# Altium project supersensor.PrjPcb
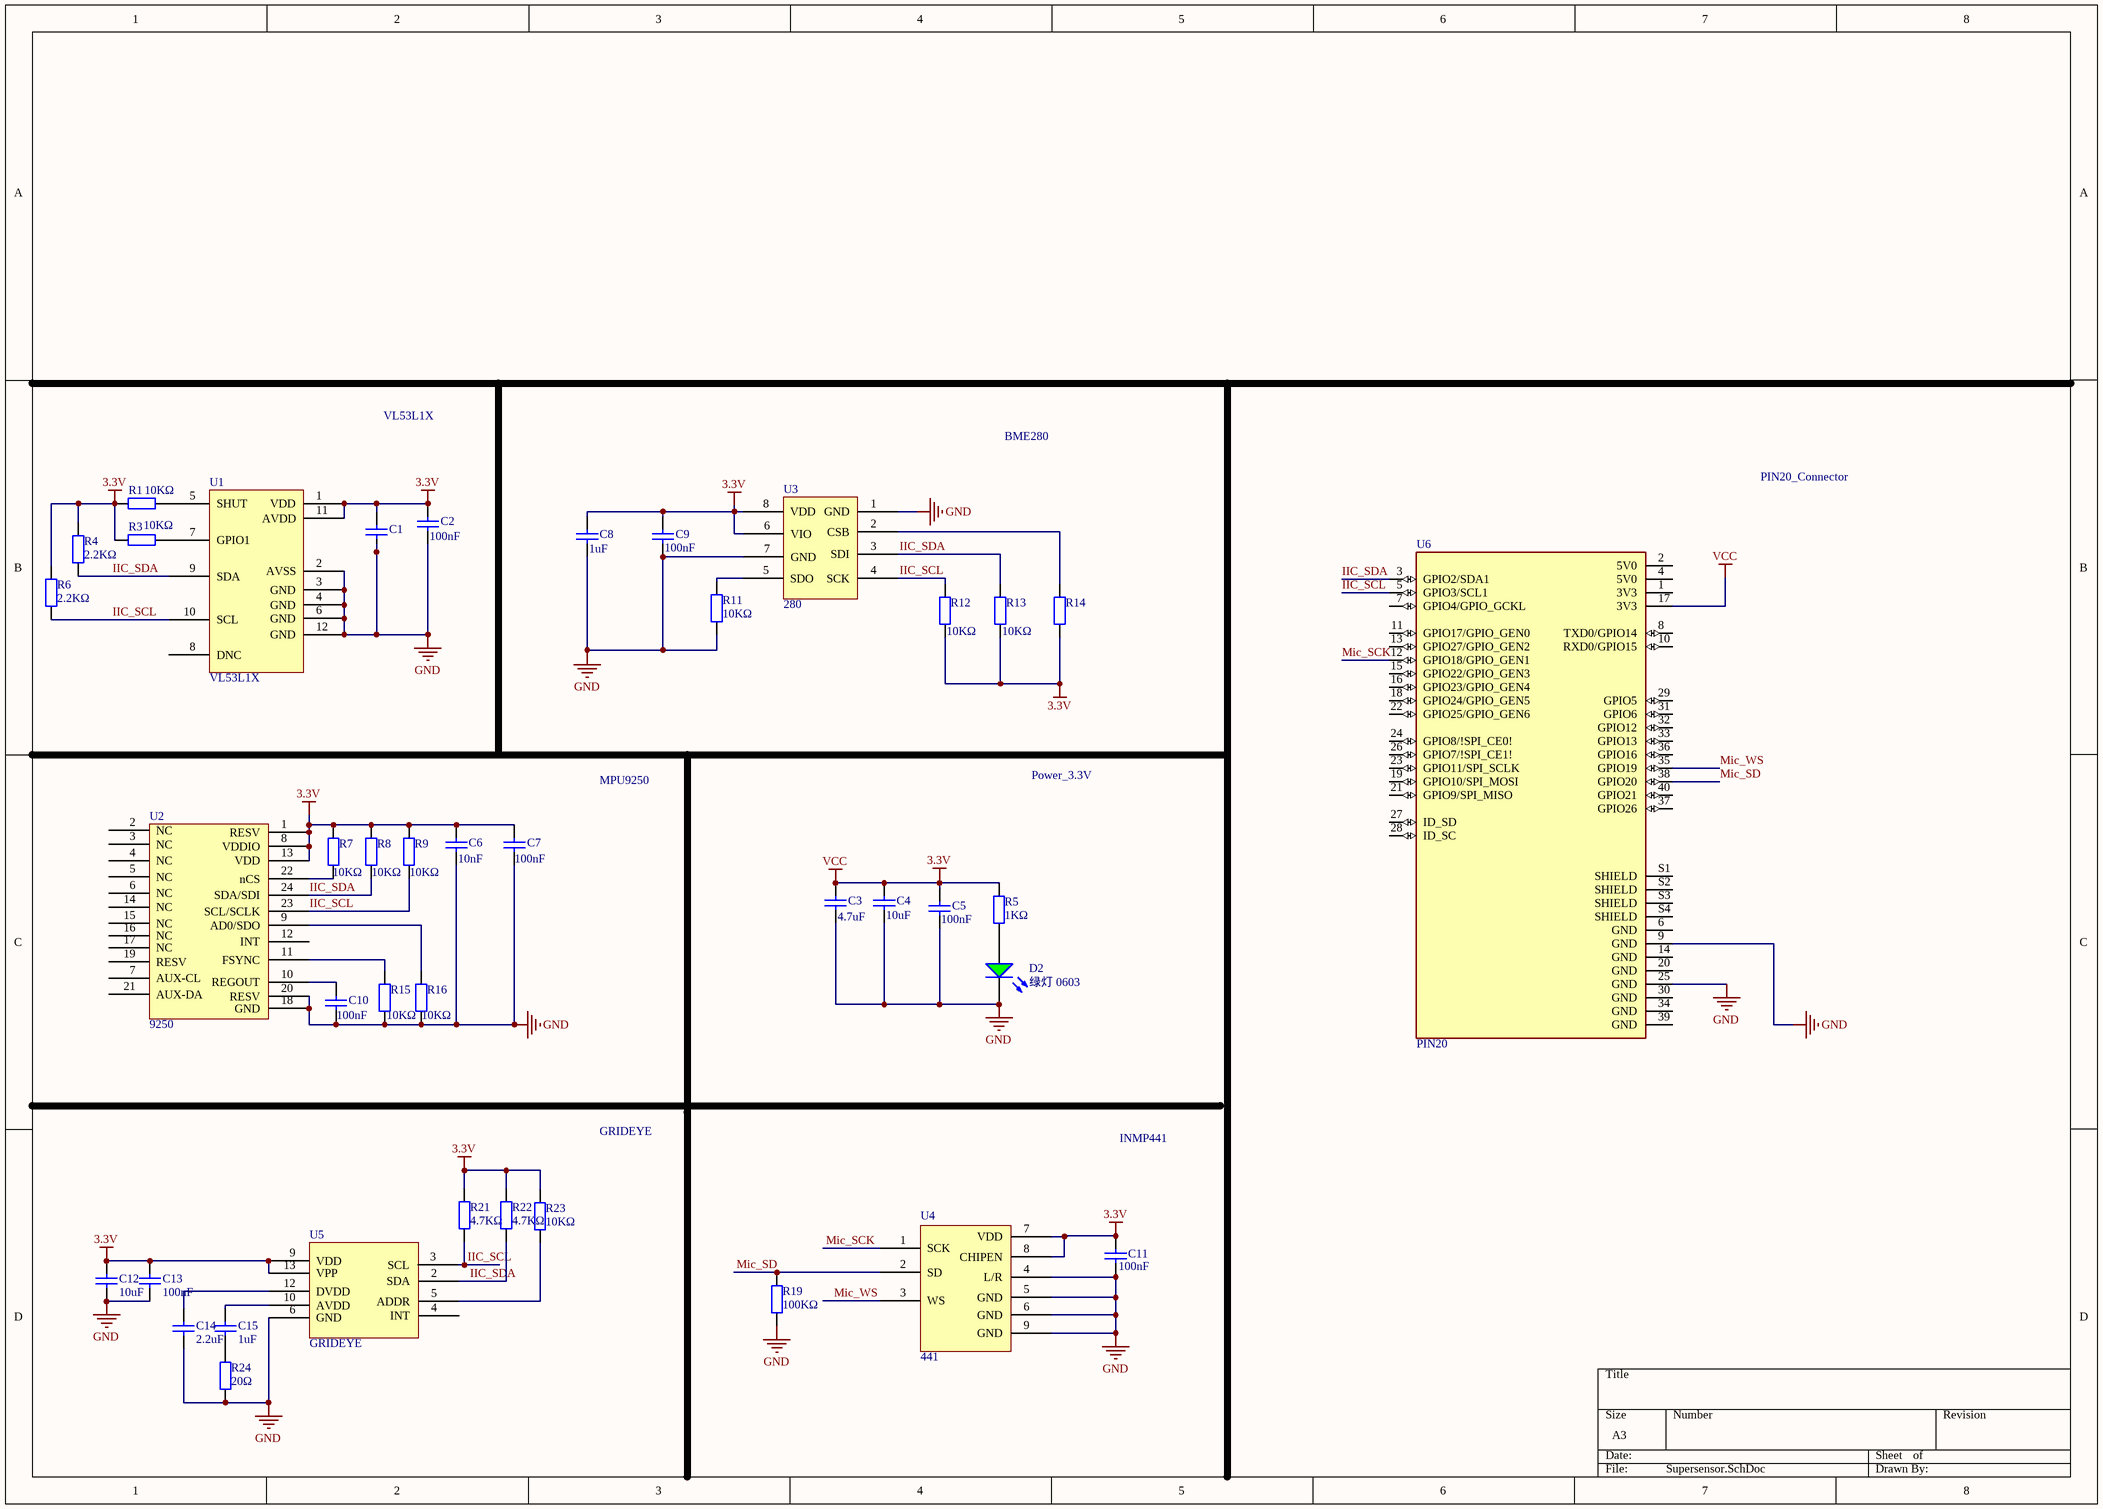
[diagram p0: Supersensor.SchDoc]
Title: Supersensor
1 sheet, 41 parts. Net scope: global (net labels, ports and power ports of the same name join across sheets).
Board file: supersensor.PcbDoc

## Sheet Supersensor.SchDoc: Supersensor
size A3; SheetNumber: 1; SheetTotal: 1

### Parts
C1  (no value)  [0603_C]
C2  100nF  [0603_C]
C3  4.7uF  [0603_C]
C4  10uF  [0603_C]
C5  100nF  [0603_C]
C6  10nF  [0603_C]
C7  100nF  [0603_C]
C8  1uF  [0603_C]
C9  100nF  [0603_C]
C10  100nF  [0603_C]
C11  100nF  [0603_C]
C12  10uF  [0603_C]
C13  100nF  [0603_C]
C14  2.2uF  [0603_C]
C15  1uF  [0603_C]
D2  绿灯 0603  [0603_LED_S1]
R1  10KΩ  [0603_R]
R3  10KΩ  [0603_R]
R4  2.2KΩ  [0603_R]
R5  1KΩ  [0603_R]
R6  2.2KΩ  [0603_R]
R7  10KΩ  [0603_R]
R8  10KΩ  [0603_R]
R9  10KΩ  [0603_R]
R11  10KΩ  [0603_R]
R12  10KΩ  [0603_R]
R13  10KΩ  [0603_R]
R14  (no value)  [0603_R]
R15  10KΩ  [0603_R]
R16  10KΩ  [0603_R]
R19  100KΩ  [0603_R]
R21  4.7KΩ  [0603_R]
R22  4.7KΩ  [0603_R]
R23  10KΩ  [0603_R]
R24  20Ω  [0603_R]
U1  VL53L1X  [VL53L1X]
U2  9250  [MPU9250]
U3  280  [BME280]
U4  441  [INMP441]
U5  GRIDEYE  [AMG8833]
U6  PIN20  [PIN20]

### Nets
3.3V: C1.2 C2.2 C3.2 C4.2 C5.2 C6.2 C7.2 C8.2 C9.2 C11.2 C12.2 C13.2 R1.1 R3.1 R4.1 R5.2 R6.1 R7.2 R8.2 R9.2 R12.1 R13.1 R14.1 R21.2 R22.2 R23.2 U1.1(VDD) U1.11(AVDD) U2.1(RESV) U2.8(VDDIO) U2.13(VDD) U3.6(VIO) U3.8(VDD) U4.7(VDD) U4.8(CHIPEN) U5.9(VDD) U5.13(VPP) U6.17(3V3)  [also labelled VCC]
GND: C1.1 C2.1 C3.1 C4.1 C5.1 C6.1 C7.1 C8.1 C9.1 C10.1 C11.1 C12.1 C13.1 C14.1 D2.K R11.1 R15.1 R16.1 R19.1 R24.1 U1.2(AVSS) U1.3(GND) U1.4(GND) U1.6(GND) U1.12(GND) U2.18(GND) U2.20(RESV) U3.1(GND) U3.7(GND) U4.4(L/R) U4.5(GND) U4.6(GND) U4.9(GND) U5.6(GND) U6.9(GND) U6.25(GND)
IIC_SCL: R6.2 R9.1 R12.2 R21.1 U1.10(SCL) U2.23(SCL/SCLK) U3.4(SCK) U5.3(SCL) U6.5(GPIO3/SCL1)
IIC_SDA: R4.2 R8.1 R13.2 R22.1 U1.9(SDA) U2.24(SDA/SDI) U3.3(SDI) U5.2(SDA) U6.3(GPIO2/SDA1)
Mic_SCK: U4.1(SCK) U6.12(GPIO18/GPIO_GEN1)
Mic_SD: R19.2 U4.2(SD) U6.38(GPIO20)
Mic_WS: U4.3(WS) U6.35(GPIO19)
NetC10_2: C10.2 U2.10(REGOUT)
NetC14_2: C14.2 U5.12(DVDD)
NetC15_1: C15.1 R24.2
NetC15_2: C15.2 U5.10(AVDD)
NetD2_A: D2.A R5.1
NetR1_2: R1.2 U1.5(SHUT)
NetR3_2: R3.2 U1.7(GPIO1)
NetR7_1: R7.1 U2.22(nCS)
NetR11_2: R11.2 U3.5(SDO)
NetR14_2: R14.2 U3.2(CSB)
NetR15_2: R15.2 U2.11(FSYNC)
NetR16_2: R16.2 U2.9(AD0/SDO)
NetR23_1: R23.1 U5.5(ADDR)

Not connected (* = marked no-connect by the designer): U1 8(DNC); U2 2(NC) 3(NC) 4(NC) 5(NC) 6(NC) 7(AUX-CL) 12(INT) 14(NC) 15(NC) 16(NC) 17(NC) 19(RESV) 21(AUX-DA); U5 4(INT); U6 1(3V3) 2(5V0) 4(5V0) 6(GND) 7(GPIO4/GPIO_GCKL) 8(TXD0/GPIO14) 10(RXD0/GPIO15) 11(GPIO17/GPIO_GEN0) 13(GPIO27/GPIO_GEN2) 14(GND) 15(GPIO22/GPIO_GEN3) 16(GPIO23/GPIO_GEN4) 18(GPIO24/GPIO_GEN5) 19(GPIO10/SPI_MOSI) 20(GND) 21(GPIO9/SPI_MISO) 22(GPIO25/GPIO_GEN6) 23(GPIO11/SPI_SCLK) 24(GPIO8/!SPI_CE0!) 26(GPIO7/!SPI_CE1!) 27(ID_SD) 28(ID_SC) 29(GPIO5) 30(GND) 31(GPIO6) 32(GPIO12) 33(GPIO13) 34(GND) 36(GPIO16) 37(GPIO26) 39(GND) 40(GPIO21) S1(SHIELD) S2(SHIELD) S3(SHIELD) S4(SHIELD)

### Notes on the sheet
- VL53L1X
- BME280
- PIN20_Connector
- MPU9250
- Power_3.3V
- GRIDEYE
- INMP441

### Library data of the parts
C1 C3 = 0603 4.7uF (475) 10% 16V: 贴片电容; ComponentLink1Description: 供应商链接; ComponentLink1URL: http://www.szlcsc.com/product/details_20375.html; Package: 0603; Supplier: LC; SuppliersPartNumber: C19666
C2 C5 C7 C9-C11 C13 = 0603 100nF (104) 10% 50V: 贴片电容; ComponentLink1Description: 供应商链接; ComponentLink1URL: http://www.szlcsc.com/product/details_15331.html; Package: 0603; Supplier: LC; SuppliersPartNumber: C14663
C4 C12 = 0603 10uF (106) 10% 10V: 贴片电容; ComponentLink1Description: 供应商链接; ComponentLink1URL: http://www.szlcsc.com/product/details_20411.html; Package: 0603; Supplier: LC; SuppliersPartNumber: C19702
C6 = 0603 10nF (103) 10% 50V: 贴片电容; ComponentLink1Description: 供应商链接; ComponentLink1URL: http://www.szlcsc.com/product/details_58143.html; Package: 0603; Supplier: LC; SuppliersPartNumber: C57112
C8 C15 = 0603 1uF (105) 10% 50V: 贴片电容; ComponentLink1Description: 供应商链接; ComponentLink1URL: http://www.szlcsc.com/product/details_16531.html; Package: 0603; Supplier: LC; SuppliersPartNumber: C15849
C14 = 0603 2.2uF (225) 10% 16V: 贴片电容; ComponentLink1Description: 供应商链接; ComponentLink1URL: http://www.szlcsc.com/product/details_24366.html; Package: 0603; Supplier: LC; SuppliersPartNumber: C23630
D2 = 0603 绿灯: 发光二极管; ComponentLink1Description: 供应商链接; ComponentLink1URL: http://www.szlcsc.com/product/details_73152.html; Package: 0603; Supplier: LC; SuppliersPartNumber: C72043
R1 R3 R7-R9 R11-R16 R23 = 0603 10KΩ (1002) 1%: 贴片电阻; ComponentLink1Description: 供应商链接; ComponentLink1URL: http://www.szlcsc.com/product/details_26547.html; Package: 0603; Supplier: LC; SuppliersPartNumber: C25804
R4 R6 = 0603 2.2KΩ (2201) 1%: 贴片电阻; ComponentLink1Description: 供应商链接; ComponentLink1URL: http://www.szlcsc.com/product/details_4597.html; Package: 0603; Supplier: LC; SuppliersPartNumber: C4190
R5 = 0603 1KΩ (1001) 1%: 贴片电阻; ComponentLink1Description: 供应商链接; ComponentLink1URL: http://www.szlcsc.com/product/details_21904.html; Package: 0603; Supplier: LC; SuppliersPartNumber: C21190
R19 = 0603 100KΩ (1003) 1%: 贴片电阻; ComponentLink1Description: 供应商链接; ComponentLink1URL: http://www.szlcsc.com/product/details_26546.html; Package: 0603; Supplier: LC; SuppliersPartNumber: C25803
R21 R22 = 0603 4.7KΩ (4701) 1%: 贴片电阻; ComponentLink1Description: 供应商链接; ComponentLink1URL: http://www.szlcsc.com/product/details_23889.html; Package: 0603; Supplier: LC; SuppliersPartNumber: C23162
R24 = 0603 20Ω (20R0) 1%: 贴片电阻; ComponentLink1Description: 供应商链接; ComponentLink1URL: http://www.szlcsc.com/product/details_23677.html; Package: 0603; Supplier: LC; SuppliersPartNumber: C22950
U1 = VL53L1X: IC
U2 = MPU9250: IC
U3 = BME280: IC
U4 = INMP441: IC
U5 = GRIDEYE: IC
U6 = PIN20: BCM2837B0 Raspberry Pi 3 Model B+ - ARMÂ® CortexÂ®-A53, VideoCore MPU Embedded Evaluation Board; MP: RASPBERRY PI 3 MODEL B+; SnapEDA_Link: https://www.snapeda.com/parts/RASPBERRY%20PI%203%20MODEL%20B+/Raspberry%20Pi/view-part/4299836/?ref=snap; Package: Raspberry Pi; MF: Raspberry Pi; Value: *; Digi-Key_Part_Number: 1690-1025-ND; Check_prices: https://www.snapeda.com/parts/RASPBERRY%20PI%203%20MODEL%20B+/Raspberry%20Pi/view-part/4299836/?ref=eda